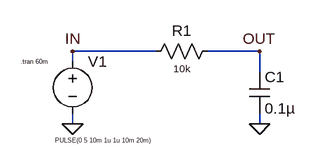
[diagram p0: schematic RC_Low_Pass_Filter.asc]
RC_Low_Pass_Filter.asc, the LTspice schematic file:
Version 4.1
SHEET 1 880 680
WIRE 256 -48 128 -48
WIRE 416 -48 336 -48
WIRE 128 -32 128 -48
WIRE 416 -16 416 -48
WIRE 128 64 128 48
WIRE 416 64 416 48
FLAG 128 64 0
FLAG 416 64 0
FLAG 128 -48 IN
FLAG 416 -48 OUT
SYMBOL voltage 128 -48 R0
WINDOW 3 -27 137 Left 0
WINDOW 123 0 0 Left 0
WINDOW 39 0 0 Left 0
SYMATTR Value PULSE(0 5 10m 1u 1u 10m 20m)
SYMATTR InstName V1
SYMBOL res 352 -64 R90
WINDOW 0 0 56 VBottom 2
WINDOW 3 32 56 VTop 1
SYMATTR InstName R1
SYMATTR Value 10k
SYMATTR SpiceLine tol=1 pwr=0.1
SYMBOL cap 400 -16 R0
SYMATTR InstName C1
SYMATTR Value 0.1µ
SYMATTR SpiceLine V=4 Irms=0 Rser=0 Lser=0 mfg="Murata" pn="GRM022R60G153KE15" type="X5R"
TEXT 48 -32 Left 0 !.tran 60m

The netlist it stands for:
* RC_Low_Pass_Filter.asc
V1 IN 0 PULSE(0 5 10m 1u 1u 10m 20m)
R1 OUT IN 10k tol=1 pwr=0.1
C1 OUT 0 0.1µ V=4 Irms=0 Rser=0 Lser=0 mfg="Murata" pn="GRM022R60G153KE15" type="X5R"
.tran 60m
.backanno
.end